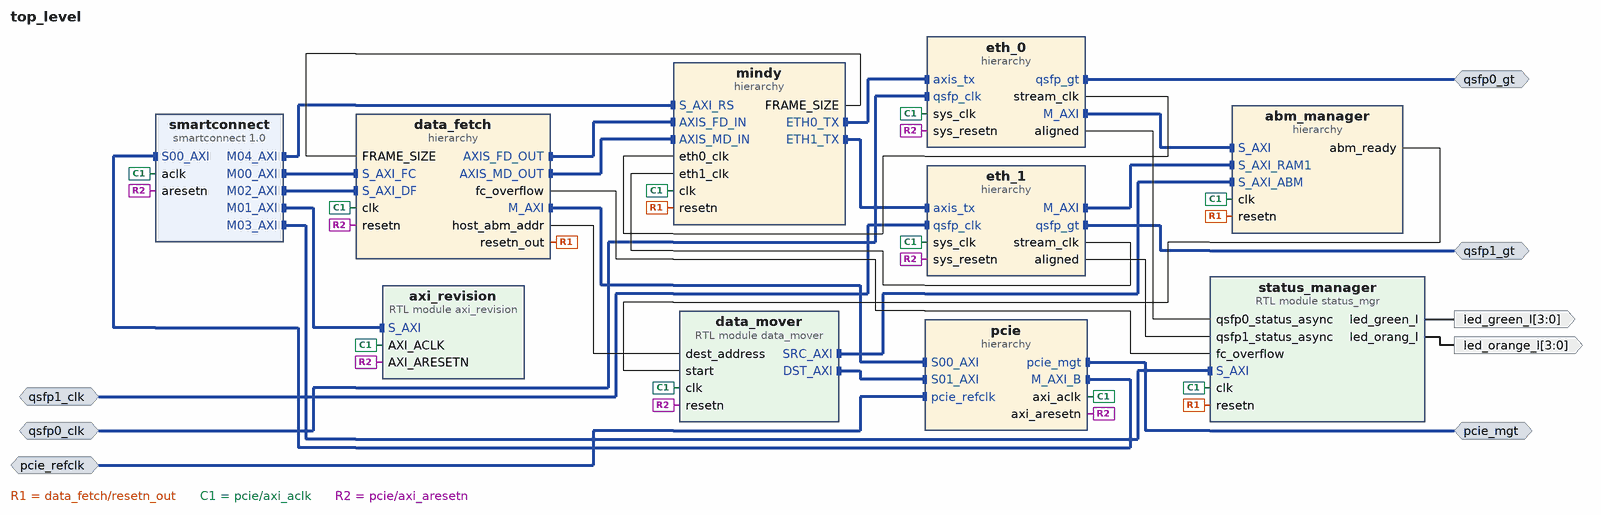
[diagram p0: block diagram of the top level]
# Vivado block design top_level, xcvu3p-ffvc1517-2-e, Vivado 2021.1
create_bd_design top_level

create_bd_intf_port -mode Slave -vlnv xilinx.com:interface:diff_clock_rtl:1.0 pcie_refclk
create_bd_intf_port -mode Master -vlnv xilinx.com:interface:pcie_7x_mgt_rtl:1.0 pcie_mgt
create_bd_intf_port -mode Slave -vlnv xilinx.com:interface:diff_clock_rtl:1.0 qsfp0_clk
set_property -dict {CONFIG.FREQ_HZ 322265625} [get_bd_intf_ports qsfp0_clk]
create_bd_intf_port -mode Master -vlnv xilinx.com:interface:gt_rtl:1.0 qsfp0_gt
create_bd_intf_port -mode Master -vlnv xilinx.com:interface:gt_rtl:1.0 qsfp1_gt
create_bd_intf_port -mode Slave -vlnv xilinx.com:interface:diff_clock_rtl:1.0 qsfp1_clk
set_property -dict {CONFIG.FREQ_HZ 322265625} [get_bd_intf_ports qsfp1_clk]
create_bd_port -dir O -from 3 -to 0 led_orange_l
create_bd_port -dir O -from 3 -to 0 led_green_l

create_bd_cell -type hier pcie
create_bd_cell -type hier eth_1
create_bd_cell -type ip -vlnv xilinx.com:ip:smartconnect:1.0 smartconnect
set_property -dict {CONFIG.NUM_CLKS 1 CONFIG.NUM_MI 5 CONFIG.NUM_SI 1} [get_bd_cells smartconnect]
create_bd_cell -type hier data_fetch
create_bd_cell -type hier mindy
create_bd_cell -type hier abm_manager
create_bd_cell -type module -reference axi_revision axi_revision
create_bd_cell -type hier eth_0
create_bd_cell -type module -reference status_mgr status_manager
create_bd_cell -type module -reference data_mover data_mover

# ---- hierarchy /pcie ----
current_bd_instance /pcie
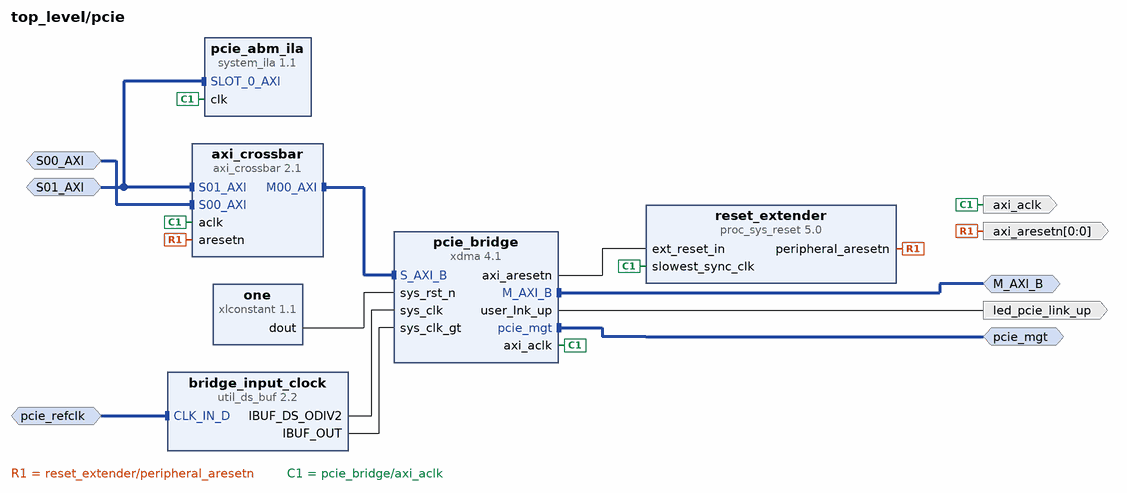
[diagram p1: block diagram inside /pcie]
create_bd_intf_pin -mode Master -vlnv xilinx.com:interface:aximm_rtl:1.0 M_AXI_B
create_bd_intf_pin -mode Master -vlnv xilinx.com:interface:pcie_7x_mgt_rtl:1.0 pcie_mgt
create_bd_intf_pin -mode Slave -vlnv xilinx.com:interface:diff_clock_rtl:1.0 pcie_refclk
create_bd_intf_pin -mode Slave -vlnv xilinx.com:interface:aximm_rtl:1.0 S00_AXI
create_bd_intf_pin -mode Slave -vlnv xilinx.com:interface:aximm_rtl:1.0 S01_AXI
create_bd_pin -dir O led_pcie_link_up
create_bd_pin -dir O -type clk axi_aclk
create_bd_pin -dir O -from 0 -to 0 -type rst axi_aresetn

create_bd_cell -type ip -vlnv xilinx.com:ip:proc_sys_reset:5.0 reset_extender
create_bd_cell -type ip -vlnv xilinx.com:ip:util_ds_buf:2.2 bridge_input_clock
set_property -dict {CONFIG.C_BUF_TYPE IBUFDSGTE} [get_bd_cells bridge_input_clock]
create_bd_cell -type ip -vlnv xilinx.com:ip:xdma:4.1 pcie_bridge
set_property -dict [list \
  CONFIG.PF0_DEVICE_ID_mqdma 903F \
  CONFIG.PF0_SRIOV_VF_DEVICE_ID A03F \
  CONFIG.PF2_DEVICE_ID_mqdma 923F \
  CONFIG.PF3_DEVICE_ID_mqdma 933F \
  CONFIG.axi_addr_width 64 \
  CONFIG.axi_data_width 512_bit \
  CONFIG.axisten_freq 250 \
  CONFIG.bridge_burst true \
  CONFIG.dma_reset_source_sel User_Reset \
  CONFIG.en_axi_slave_if true \
  CONFIG.enable_jtag_dbg false \
  CONFIG.functional_mode AXI_Bridge \
  CONFIG.mode_selection Advanced \
  CONFIG.pcie_blk_locn X1Y0 \
  CONFIG.pf0_bar0_scale Megabytes \
  CONFIG.pf0_bar0_size 1 \
  CONFIG.pf0_device_id 903F \
  CONFIG.pl_link_cap_max_link_speed 8.0_GT/s \
  CONFIG.pl_link_cap_max_link_width X16 \
  CONFIG.plltype QPLL1 \
] [get_bd_cells pcie_bridge]
create_bd_cell -type ip -vlnv xilinx.com:ip:xlconstant:1.1 one
create_bd_cell -type ip -vlnv xilinx.com:ip:axi_crossbar:2.1 axi_crossbar
set_property -dict [list \
  CONFIG.M00_S00_READ_CONNECTIVITY 1 \
  CONFIG.M00_S00_WRITE_CONNECTIVITY 0 \
  CONFIG.M00_S01_READ_CONNECTIVITY 0 \
  CONFIG.M00_S01_WRITE_CONNECTIVITY 1 \
  CONFIG.NUM_MI 1 \
  CONFIG.NUM_SI 2 \
  CONFIG.S00_ARB_PRIORITY 15 \
  CONFIG.S01_ARB_PRIORITY 1 \
  CONFIG.STRATEGY 2 \
] [get_bd_cells axi_crossbar]
create_bd_cell -type ip -vlnv xilinx.com:ip:system_ila:1.1 pcie_abm_ila

# ---- hierarchy /eth_1 ----
current_bd_instance /eth_1
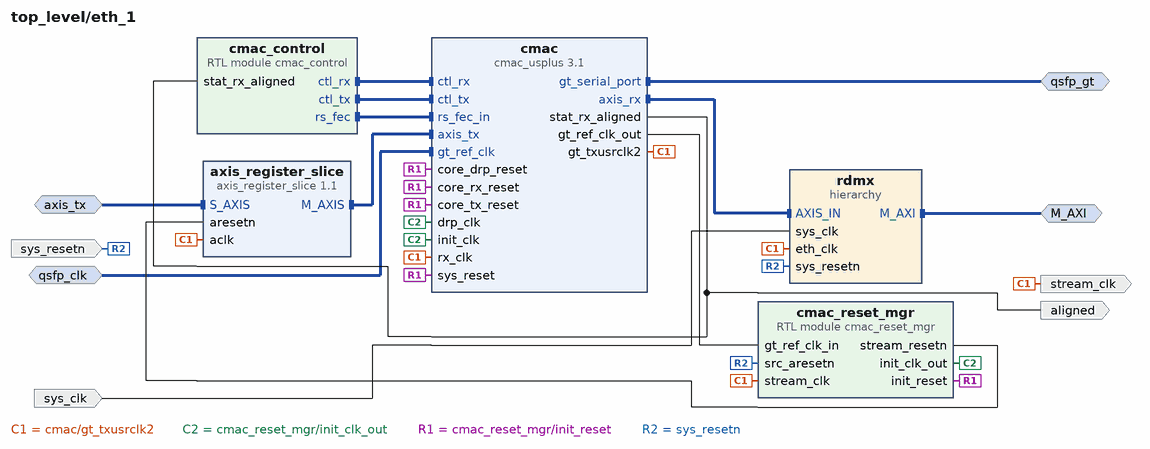
[diagram p2: block diagram inside /eth_1]
create_bd_intf_pin -mode Master -vlnv xilinx.com:interface:gt_rtl:1.0 qsfp_gt
create_bd_intf_pin -mode Slave -vlnv xilinx.com:interface:axis_rtl:1.0 axis_tx
create_bd_intf_pin -mode Slave -vlnv xilinx.com:interface:diff_clock_rtl:1.0 qsfp_clk
create_bd_intf_pin -mode Master -vlnv xilinx.com:interface:aximm_rtl:1.0 M_AXI
create_bd_pin -dir I -type rst sys_resetn
create_bd_pin -dir O -type clk stream_clk
create_bd_pin -dir O aligned
create_bd_pin -dir I sys_clk

create_bd_cell -type ip -vlnv xilinx.com:ip:cmac_usplus:3.1 cmac
set_property -dict [list \
  CONFIG.CMAC_CAUI4_MODE 1 \
  CONFIG.CMAC_CORE_SELECT CMACE4_X0Y0 \
  CONFIG.GT_DRP_CLK 161.132812 \
  CONFIG.GT_GROUP_SELECT {X0Y4~X0Y7} \
  CONFIG.GT_REF_CLK_FREQ 322.265625 \
  CONFIG.INCLUDE_RS_FEC 1 \
  CONFIG.NUM_LANES 4x25 \
  CONFIG.RX_FLOW_CONTROL 0 \
  CONFIG.TX_FLOW_CONTROL 0 \
  CONFIG.USER_INTERFACE AXIS \
] [get_bd_cells cmac]
create_bd_cell -type module -reference cmac_control cmac_control
create_bd_cell -type module -reference cmac_reset_mgr cmac_reset_mgr
create_bd_cell -type ip -vlnv xilinx.com:ip:axis_register_slice:1.1 axis_register_slice
create_bd_cell -type hier rdmx

# ---- hierarchy /eth_1/rdmx ----
current_bd_instance /eth_1/rdmx
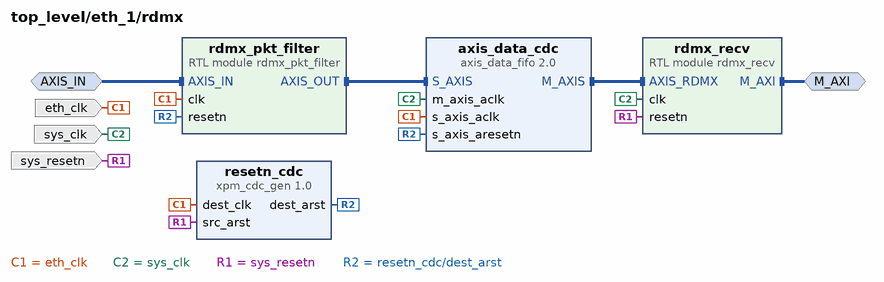
[diagram p3: block diagram inside /eth_1/rdmx]
create_bd_intf_pin -mode Slave -vlnv xilinx.com:interface:axis_rtl:1.0 AXIS_IN
create_bd_intf_pin -mode Master -vlnv xilinx.com:interface:aximm_rtl:1.0 M_AXI
create_bd_pin -dir I eth_clk
create_bd_pin -dir I sys_resetn
create_bd_pin -dir I sys_clk

create_bd_cell -type module -reference rdmx_pkt_filter rdmx_pkt_filter
create_bd_cell -type ip -vlnv xilinx.com:ip:axis_data_fifo:2.0 axis_data_cdc
set_property -dict {CONFIG.FIFO_DEPTH 16 CONFIG.FIFO_MEMORY_TYPE distributed CONFIG.IS_ACLK_ASYNC 1} [get_bd_cells axis_data_cdc]
create_bd_cell -type ip -vlnv xilinx.com:ip:xpm_cdc_gen:1.0 resetn_cdc
set_property -dict {CONFIG.CDC_TYPE xpm_cdc_async_rst} [get_bd_cells resetn_cdc]
create_bd_cell -type module -reference rdmx_recv rdmx_recv

# ---- hierarchy /data_fetch ----
current_bd_instance /data_fetch
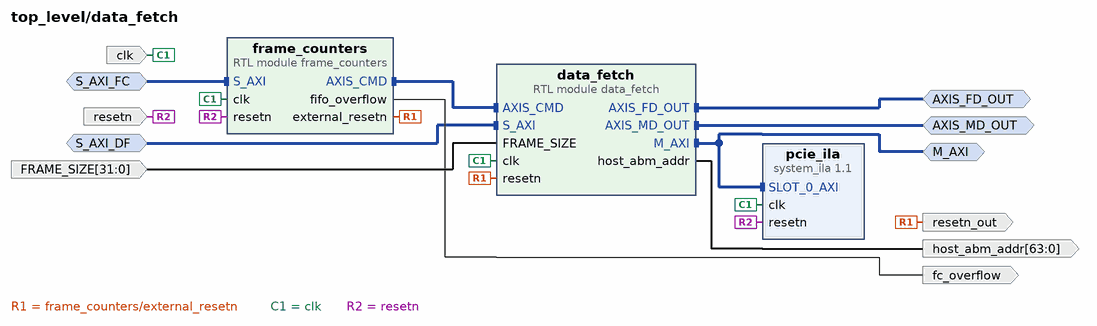
[diagram p4: block diagram inside /data_fetch]
create_bd_intf_pin -mode Slave -vlnv xilinx.com:interface:aximm_rtl:1.0 S_AXI_FC
create_bd_intf_pin -mode Master -vlnv xilinx.com:interface:axis_rtl:1.0 AXIS_MD_OUT
create_bd_intf_pin -mode Master -vlnv xilinx.com:interface:aximm_rtl:1.0 M_AXI
create_bd_intf_pin -mode Slave -vlnv xilinx.com:interface:aximm_rtl:1.0 S_AXI_DF
create_bd_intf_pin -mode Master -vlnv xilinx.com:interface:axis_rtl:1.0 AXIS_FD_OUT
create_bd_pin -dir I -type clk clk
create_bd_pin -dir I -type rst resetn
create_bd_pin -dir O fc_overflow
create_bd_pin -dir O -type rst resetn_out
create_bd_pin -dir I -from 31 -to 0 FRAME_SIZE
create_bd_pin -dir O -from 63 -to 0 host_abm_addr

create_bd_cell -type module -reference frame_counters frame_counters
create_bd_cell -type ip -vlnv xilinx.com:ip:system_ila:1.1 pcie_ila
set_property -dict [list \
  CONFIG.C_DATA_DEPTH 1024 \
  CONFIG.C_MON_TYPE INTERFACE \
  CONFIG.C_NUM_MONITOR_SLOTS 1 \
  CONFIG.C_NUM_OF_PROBES 3 \
  CONFIG.C_SLOT 0 \
  CONFIG.C_SLOT_1_INTF_TYPE xilinx.com:interface:axis_rtl:1.0 \
  CONFIG.C_SLOT_2_INTF_TYPE xilinx.com:interface:axis_rtl:1.0 \
  CONFIG.C_SLOT_4_INTF_TYPE xilinx.com:interface:axis_rtl:1.0 \
] [get_bd_cells pcie_ila]
create_bd_cell -type module -reference data_fetch data_fetch
set_property -dict {CONFIG.FD_FIFO_DEPTH 16 CONFIG.FD_FIFO_TYPE distributed} [get_bd_cells data_fetch]

# ---- hierarchy /mindy ----
current_bd_instance /mindy
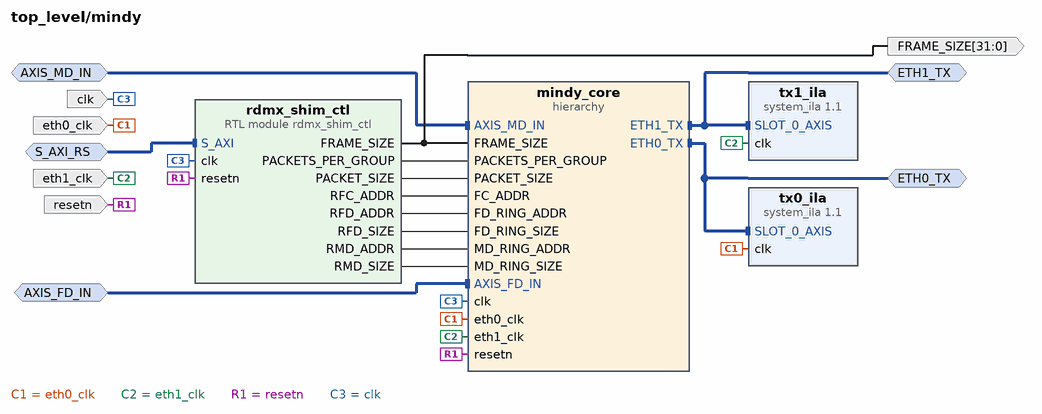
[diagram p5: block diagram inside /mindy]
create_bd_intf_pin -mode Slave -vlnv xilinx.com:interface:aximm_rtl:1.0 S_AXI_RS
create_bd_intf_pin -mode Master -vlnv xilinx.com:interface:axis_rtl:1.0 ETH0_TX
create_bd_intf_pin -mode Master -vlnv xilinx.com:interface:axis_rtl:1.0 ETH1_TX
create_bd_intf_pin -mode Slave -vlnv xilinx.com:interface:axis_rtl:1.0 AXIS_FD_IN
create_bd_intf_pin -mode Slave -vlnv xilinx.com:interface:axis_rtl:1.0 AXIS_MD_IN
create_bd_pin -dir I -type clk clk
create_bd_pin -dir I -type clk eth0_clk
create_bd_pin -dir I -type clk eth1_clk
create_bd_pin -dir I -type rst resetn
create_bd_pin -dir O -from 31 -to 0 FRAME_SIZE

create_bd_cell -type hier mindy_core
create_bd_cell -type module -reference rdmx_shim_ctl rdmx_shim_ctl
create_bd_cell -type ip -vlnv xilinx.com:ip:system_ila:1.1 tx0_ila
set_property -dict {CONFIG.C_SLOT_0_INTF_TYPE xilinx.com:interface:axis_rtl:1.0} [get_bd_cells tx0_ila]
create_bd_cell -type ip -vlnv xilinx.com:ip:system_ila:1.1 tx1_ila
set_property -dict {CONFIG.C_SLOT_0_INTF_TYPE xilinx.com:interface:axis_rtl:1.0} [get_bd_cells tx1_ila]

# ---- hierarchy /mindy/mindy_core ----
current_bd_instance /mindy/mindy_core
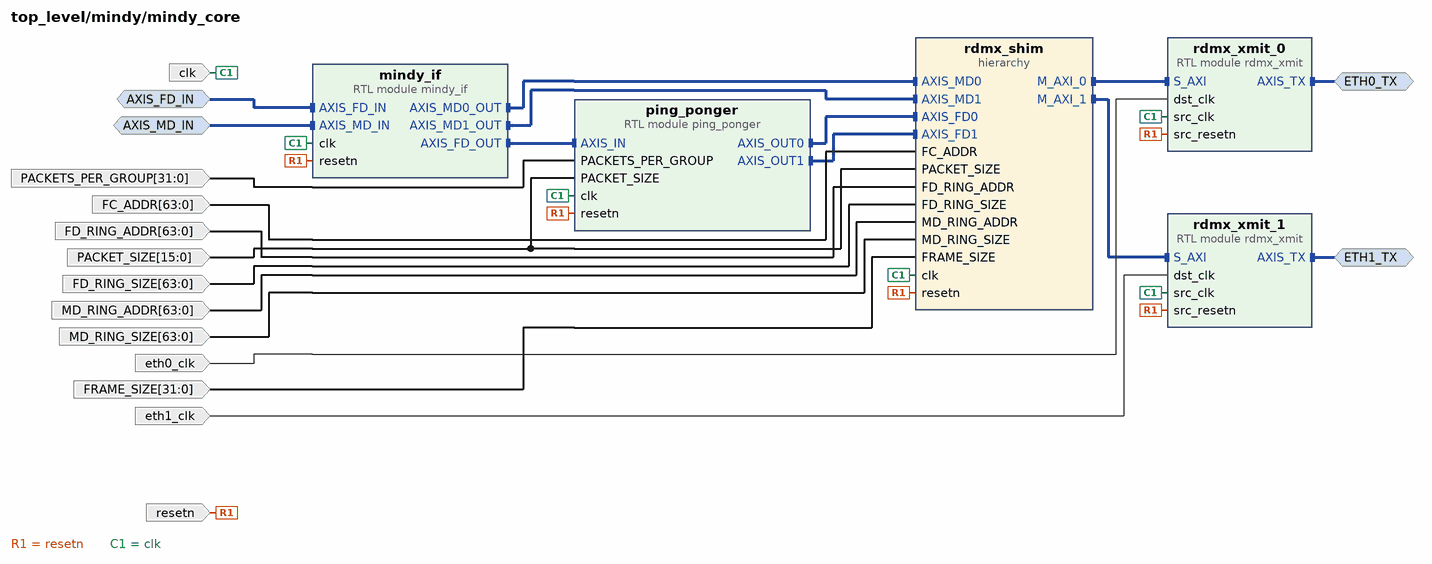
[diagram p6: block diagram inside /mindy/mindy_core]
create_bd_intf_pin -mode Master -vlnv xilinx.com:interface:axis_rtl:1.0 ETH0_TX
create_bd_intf_pin -mode Master -vlnv xilinx.com:interface:axis_rtl:1.0 ETH1_TX
create_bd_intf_pin -mode Slave -vlnv xilinx.com:interface:axis_rtl:1.0 AXIS_FD_IN
create_bd_intf_pin -mode Slave -vlnv xilinx.com:interface:axis_rtl:1.0 AXIS_MD_IN
create_bd_pin -dir I -type clk clk
create_bd_pin -dir I -type clk eth0_clk
create_bd_pin -dir I -type clk eth1_clk
create_bd_pin -dir I -type rst resetn
create_bd_pin -dir I -from 63 -to 0 MD_RING_SIZE
create_bd_pin -dir I -from 15 -to 0 PACKET_SIZE
create_bd_pin -dir I -from 31 -to 0 FRAME_SIZE
create_bd_pin -dir I -from 63 -to 0 MD_RING_ADDR
create_bd_pin -dir I -from 63 -to 0 FC_ADDR
create_bd_pin -dir I -from 63 -to 0 FD_RING_ADDR
create_bd_pin -dir I -from 63 -to 0 FD_RING_SIZE
create_bd_pin -dir I -from 31 -to 0 PACKETS_PER_GROUP

create_bd_cell -type module -reference ping_ponger ping_ponger
create_bd_cell -type hier rdmx_shim
create_bd_cell -type module -reference rdmx_xmit rdmx_xmit_1
create_bd_cell -type module -reference mindy_if mindy_if
create_bd_cell -type module -reference rdmx_xmit rdmx_xmit_0

# ---- hierarchy /mindy/mindy_core/rdmx_shim ----
current_bd_instance /mindy/mindy_core/rdmx_shim
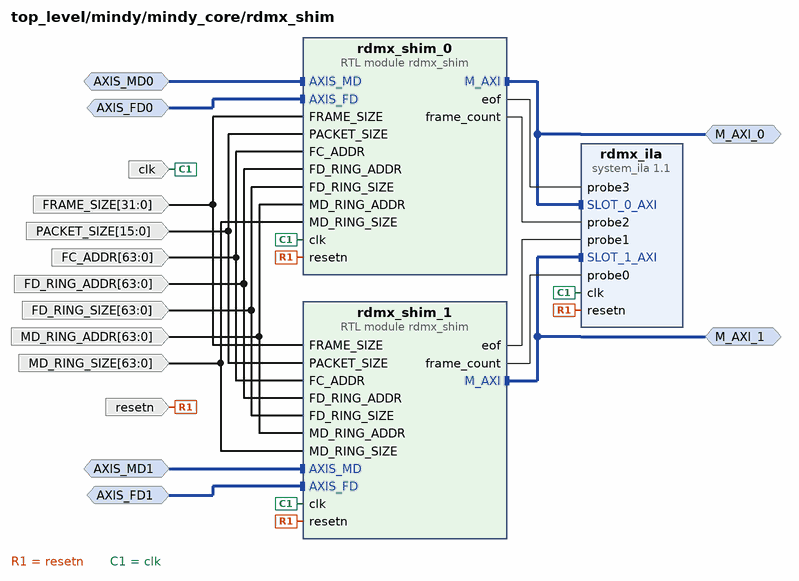
[diagram p7: block diagram inside /mindy/mindy_core/rdmx_shim]
create_bd_intf_pin -mode Slave -vlnv xilinx.com:interface:axis_rtl:1.0 AXIS_FD0
create_bd_intf_pin -mode Slave -vlnv xilinx.com:interface:axis_rtl:1.0 AXIS_MD0
create_bd_intf_pin -mode Master -vlnv xilinx.com:interface:aximm_rtl:1.0 M_AXI_0
create_bd_intf_pin -mode Slave -vlnv xilinx.com:interface:axis_rtl:1.0 AXIS_FD1
create_bd_intf_pin -mode Slave -vlnv xilinx.com:interface:axis_rtl:1.0 AXIS_MD1
create_bd_intf_pin -mode Master -vlnv xilinx.com:interface:aximm_rtl:1.0 M_AXI_1
create_bd_pin -dir I -type clk clk
create_bd_pin -dir I -type rst resetn
create_bd_pin -dir I -from 15 -to 0 PACKET_SIZE
create_bd_pin -dir I -from 63 -to 0 MD_RING_SIZE
create_bd_pin -dir I -from 63 -to 0 MD_RING_ADDR
create_bd_pin -dir I -from 63 -to 0 FC_ADDR
create_bd_pin -dir I -from 31 -to 0 FRAME_SIZE
create_bd_pin -dir I -from 63 -to 0 FD_RING_ADDR
create_bd_pin -dir I -from 63 -to 0 FD_RING_SIZE

create_bd_cell -type ip -vlnv xilinx.com:ip:system_ila:1.1 rdmx_ila
set_property -dict {CONFIG.C_MON_TYPE MIX CONFIG.C_NUM_MONITOR_SLOTS 2 CONFIG.C_NUM_OF_PROBES 4} [get_bd_cells rdmx_ila]
create_bd_cell -type module -reference rdmx_shim rdmx_shim_0
create_bd_cell -type module -reference rdmx_shim rdmx_shim_1

# ---- hierarchy /abm_manager ----
current_bd_instance /abm_manager
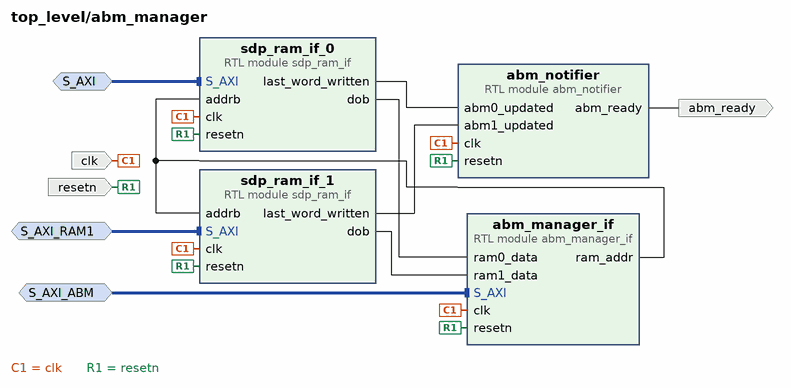
[diagram p8: block diagram inside /abm_manager]
create_bd_intf_pin -mode Slave -vlnv xilinx.com:interface:aximm_rtl:1.0 S_AXI_ABM
create_bd_intf_pin -mode Slave -vlnv xilinx.com:interface:aximm_rtl:1.0 S_AXI_RAM1
create_bd_intf_pin -mode Slave -vlnv xilinx.com:interface:aximm_rtl:1.0 S_AXI
create_bd_pin -dir I clk
create_bd_pin -dir I resetn
create_bd_pin -dir O abm_ready

create_bd_cell -type module -reference abm_manager_if abm_manager_if
create_bd_cell -type module -reference abm_notifier abm_notifier
create_bd_cell -type module -reference sdp_ram_if sdp_ram_if_0
create_bd_cell -type module -reference sdp_ram_if sdp_ram_if_1

# ---- hierarchy /eth_0 ----
current_bd_instance /eth_0
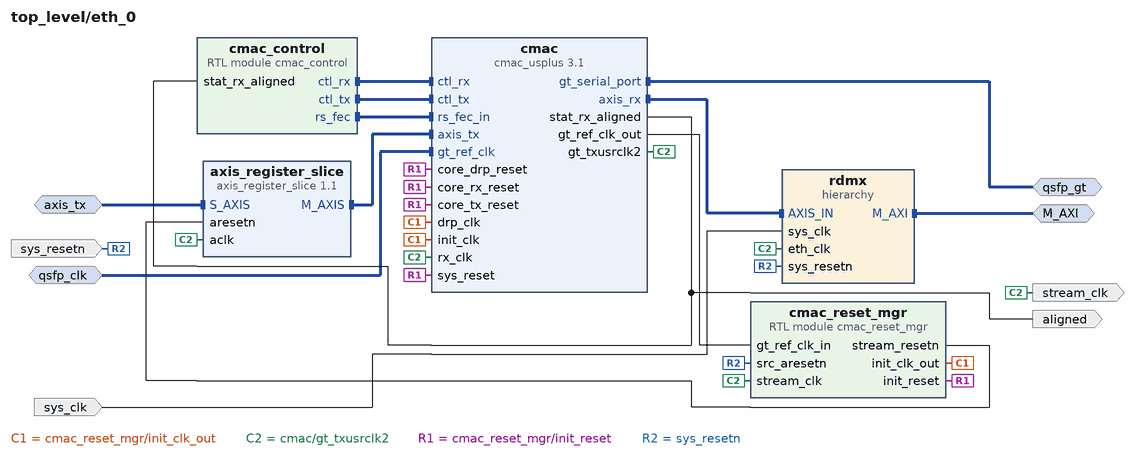
[diagram p9: block diagram inside /eth_0]
create_bd_intf_pin -mode Master -vlnv xilinx.com:interface:gt_rtl:1.0 qsfp_gt
create_bd_intf_pin -mode Slave -vlnv xilinx.com:interface:diff_clock_rtl:1.0 qsfp_clk
create_bd_intf_pin -mode Slave -vlnv xilinx.com:interface:axis_rtl:1.0 axis_tx
create_bd_intf_pin -mode Master -vlnv xilinx.com:interface:aximm_rtl:1.0 M_AXI
create_bd_pin -dir I -type rst sys_resetn
create_bd_pin -dir O -type clk stream_clk
create_bd_pin -dir O aligned
create_bd_pin -dir I sys_clk

create_bd_cell -type module -reference cmac_control cmac_control
create_bd_cell -type ip -vlnv xilinx.com:ip:cmac_usplus:3.1 cmac
set_property -dict [list \
  CONFIG.CMAC_CAUI4_MODE 1 \
  CONFIG.CMAC_CORE_SELECT CMACE4_X0Y2 \
  CONFIG.GT_DRP_CLK 161.132812 \
  CONFIG.GT_GROUP_SELECT {X0Y16~X0Y19} \
  CONFIG.GT_REF_CLK_FREQ 322.265625 \
  CONFIG.INCLUDE_RS_FEC 1 \
  CONFIG.NUM_LANES 4x25 \
  CONFIG.RX_FLOW_CONTROL 0 \
  CONFIG.TX_FLOW_CONTROL 0 \
  CONFIG.USER_INTERFACE AXIS \
] [get_bd_cells cmac]
create_bd_cell -type module -reference cmac_reset_mgr cmac_reset_mgr
create_bd_cell -type ip -vlnv xilinx.com:ip:axis_register_slice:1.1 axis_register_slice
create_bd_cell -type hier rdmx

# ---- hierarchy /eth_0/rdmx ----
current_bd_instance /eth_0/rdmx
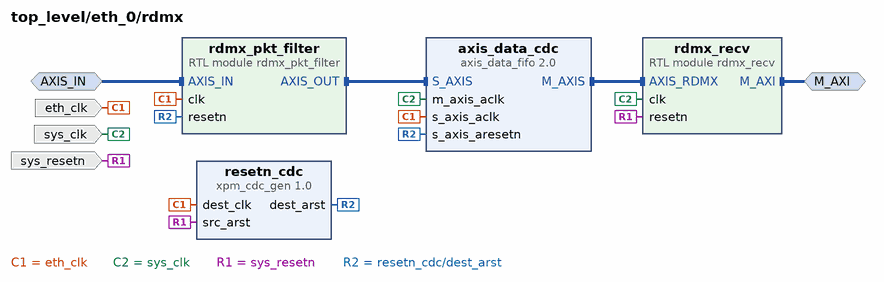
[diagram p10: block diagram inside /eth_0/rdmx]
create_bd_intf_pin -mode Slave -vlnv xilinx.com:interface:axis_rtl:1.0 AXIS_IN
create_bd_intf_pin -mode Master -vlnv xilinx.com:interface:aximm_rtl:1.0 M_AXI
create_bd_pin -dir I eth_clk
create_bd_pin -dir I sys_resetn
create_bd_pin -dir I sys_clk

create_bd_cell -type module -reference rdmx_pkt_filter rdmx_pkt_filter
create_bd_cell -type ip -vlnv xilinx.com:ip:axis_data_fifo:2.0 axis_data_cdc
set_property -dict {CONFIG.FIFO_DEPTH 16 CONFIG.FIFO_MEMORY_TYPE distributed CONFIG.IS_ACLK_ASYNC 1} [get_bd_cells axis_data_cdc]
create_bd_cell -type ip -vlnv xilinx.com:ip:xpm_cdc_gen:1.0 resetn_cdc
set_property -dict {CONFIG.CDC_TYPE xpm_cdc_async_rst} [get_bd_cells resetn_cdc]
create_bd_cell -type module -reference rdmx_recv rdmx_recv

# ---- connections ----

current_bd_instance /pcie
connect_bd_intf_net [get_bd_intf_pins S01_AXI] [get_bd_intf_pins axi_crossbar/S01_AXI]
connect_bd_intf_net [get_bd_intf_pins S01_AXI] [get_bd_intf_pins pcie_abm_ila/SLOT_0_AXI]
connect_bd_intf_net [get_bd_intf_pins pcie_refclk] [get_bd_intf_pins bridge_input_clock/CLK_IN_D]
connect_bd_intf_net [get_bd_intf_pins S00_AXI] [get_bd_intf_pins axi_crossbar/S00_AXI]
connect_bd_intf_net [get_bd_intf_pins pcie_bridge/S_AXI_B] [get_bd_intf_pins axi_crossbar/M00_AXI]
connect_bd_intf_net [get_bd_intf_pins M_AXI_B] [get_bd_intf_pins pcie_bridge/M_AXI_B]
connect_bd_intf_net [get_bd_intf_pins pcie_mgt] [get_bd_intf_pins pcie_bridge/pcie_mgt]
connect_bd_net [get_bd_pins bridge_input_clock/IBUF_DS_ODIV2] [get_bd_pins pcie_bridge/sys_clk]
connect_bd_net [get_bd_pins bridge_input_clock/IBUF_OUT] [get_bd_pins pcie_bridge/sys_clk_gt]
connect_bd_net [get_bd_pins one/dout] [get_bd_pins pcie_bridge/sys_rst_n]
connect_bd_net [get_bd_pins pcie_bridge/axi_aresetn] [get_bd_pins reset_extender/ext_reset_in]
connect_bd_net -net proc_sys_reset_0_peripheral_aresetn [get_bd_pins reset_extender/peripheral_aresetn] \
  [get_bd_pins axi_aresetn] [get_bd_pins axi_crossbar/aresetn]
connect_bd_net -net xdma_0_axi_aclk [get_bd_pins pcie_bridge/axi_aclk] \
  [get_bd_pins axi_aclk] [get_bd_pins reset_extender/slowest_sync_clk] [get_bd_pins axi_crossbar/aclk] \
  [get_bd_pins pcie_abm_ila/clk]
connect_bd_net -net xdma_0_user_lnk_up [get_bd_pins pcie_bridge/user_lnk_up] [get_bd_pins led_pcie_link_up]

current_bd_instance /eth_1
connect_bd_intf_net [get_bd_intf_pins M_AXI] [get_bd_intf_pins rdmx/M_AXI]
connect_bd_intf_net [get_bd_intf_pins qsfp_clk] [get_bd_intf_pins cmac/gt_ref_clk]
connect_bd_intf_net [get_bd_intf_pins cmac/axis_tx] [get_bd_intf_pins axis_register_slice/M_AXIS]
connect_bd_intf_net [get_bd_intf_pins axis_tx] [get_bd_intf_pins axis_register_slice/S_AXIS]
connect_bd_intf_net [get_bd_intf_pins cmac/axis_rx] [get_bd_intf_pins rdmx/AXIS_IN]
connect_bd_intf_net [get_bd_intf_pins cmac_control/ctl_rx] [get_bd_intf_pins cmac/ctl_rx]
connect_bd_intf_net [get_bd_intf_pins cmac_control/ctl_tx] [get_bd_intf_pins cmac/ctl_tx]
connect_bd_intf_net [get_bd_intf_pins cmac_control/rs_fec] [get_bd_intf_pins cmac/rs_fec_in]
connect_bd_intf_net [get_bd_intf_pins qsfp_gt] [get_bd_intf_pins cmac/gt_serial_port]
connect_bd_net -net clk_0_1 [get_bd_pins cmac/gt_ref_clk_out] [get_bd_pins cmac_reset_mgr/gt_ref_clk_in]
connect_bd_net -net cmac_gt_rxusrclk2 [get_bd_pins cmac/gt_txusrclk2] \
  [get_bd_pins stream_clk] [get_bd_pins cmac/rx_clk] [get_bd_pins cmac_reset_mgr/stream_clk] \
  [get_bd_pins axis_register_slice/aclk] [get_bd_pins rdmx/eth_clk]
connect_bd_net -net cmac_reset_mgr_0_stream_resetn [get_bd_pins cmac_reset_mgr/stream_resetn] [get_bd_pins axis_register_slice/aresetn]
connect_bd_net [get_bd_pins cmac/stat_rx_aligned] [get_bd_pins aligned] [get_bd_pins cmac_control/stat_rx_aligned]
connect_bd_net -net init_clk_divider_init_clk [get_bd_pins cmac_reset_mgr/init_clk_out] [get_bd_pins cmac/init_clk] [get_bd_pins cmac/drp_clk]
connect_bd_net -net init_reset [get_bd_pins cmac_reset_mgr/init_reset] \
  [get_bd_pins cmac/sys_reset] [get_bd_pins cmac/core_rx_reset] [get_bd_pins cmac/core_tx_reset] \
  [get_bd_pins cmac/core_drp_reset]
connect_bd_net [get_bd_pins sys_clk] [get_bd_pins rdmx/sys_clk]
connect_bd_net -net sys_reset_1 [get_bd_pins sys_resetn] [get_bd_pins cmac_reset_mgr/src_aresetn] [get_bd_pins rdmx/sys_resetn]

current_bd_instance /eth_1/rdmx
connect_bd_intf_net [get_bd_intf_pins AXIS_IN] [get_bd_intf_pins rdmx_pkt_filter/AXIS_IN]
connect_bd_intf_net [get_bd_intf_pins rdmx_recv/AXIS_RDMX] [get_bd_intf_pins axis_data_cdc/M_AXIS]
connect_bd_intf_net [get_bd_intf_pins rdmx_pkt_filter/AXIS_OUT] [get_bd_intf_pins axis_data_cdc/S_AXIS]
connect_bd_intf_net [get_bd_intf_pins M_AXI] [get_bd_intf_pins rdmx_recv/M_AXI]
connect_bd_net -net clk_1 [get_bd_pins eth_clk] \
  [get_bd_pins rdmx_pkt_filter/clk] [get_bd_pins resetn_cdc/dest_clk] [get_bd_pins axis_data_cdc/s_axis_aclk]
connect_bd_net [get_bd_pins sys_clk] [get_bd_pins axis_data_cdc/m_axis_aclk] [get_bd_pins rdmx_recv/clk]
connect_bd_net [get_bd_pins sys_resetn] [get_bd_pins resetn_cdc/src_arst] [get_bd_pins rdmx_recv/resetn]
connect_bd_net -net xpm_cdc_gen_0_dest_arst [get_bd_pins resetn_cdc/dest_arst] \
  [get_bd_pins rdmx_pkt_filter/resetn] [get_bd_pins axis_data_cdc/s_axis_aresetn]

current_bd_instance /data_fetch
connect_bd_intf_net [get_bd_intf_pins frame_counters/AXIS_CMD] [get_bd_intf_pins data_fetch/AXIS_CMD]
connect_bd_intf_net [get_bd_intf_pins AXIS_FD_OUT] [get_bd_intf_pins data_fetch/AXIS_FD_OUT]
connect_bd_intf_net [get_bd_intf_pins AXIS_MD_OUT] [get_bd_intf_pins data_fetch/AXIS_MD_OUT]
connect_bd_intf_net [get_bd_intf_pins M_AXI] [get_bd_intf_pins data_fetch/M_AXI]
connect_bd_intf_net [get_bd_intf_pins M_AXI] [get_bd_intf_pins pcie_ila/SLOT_0_AXI]
connect_bd_intf_net [get_bd_intf_pins S_AXI_FC] [get_bd_intf_pins frame_counters/S_AXI]
connect_bd_intf_net [get_bd_intf_pins S_AXI_DF] [get_bd_intf_pins data_fetch/S_AXI]
connect_bd_net [get_bd_pins data_fetch/host_abm_addr] [get_bd_pins host_abm_addr]
connect_bd_net [get_bd_pins frame_counters/external_resetn] [get_bd_pins resetn_out] [get_bd_pins data_fetch/resetn]
connect_bd_net [get_bd_pins frame_counters/fifo_overflow] [get_bd_pins fc_overflow]
connect_bd_net -net mindy_FRAME_SIZE [get_bd_pins FRAME_SIZE] [get_bd_pins data_fetch/FRAME_SIZE]
connect_bd_net -net source_200Mhz_clk [get_bd_pins clk] [get_bd_pins frame_counters/clk] [get_bd_pins pcie_ila/clk] [get_bd_pins data_fetch/clk]
connect_bd_net -net source_200Mhz_resetn [get_bd_pins resetn] [get_bd_pins frame_counters/resetn] [get_bd_pins pcie_ila/resetn]

current_bd_instance /mindy
connect_bd_intf_net [get_bd_intf_pins AXIS_MD_IN] [get_bd_intf_pins mindy_core/AXIS_MD_IN]
connect_bd_intf_net [get_bd_intf_pins ETH0_TX] [get_bd_intf_pins mindy_core/ETH0_TX]
connect_bd_intf_net [get_bd_intf_pins ETH0_TX] [get_bd_intf_pins tx0_ila/SLOT_0_AXIS]
connect_bd_intf_net [get_bd_intf_pins ETH1_TX] [get_bd_intf_pins mindy_core/ETH1_TX]
connect_bd_intf_net [get_bd_intf_pins ETH1_TX] [get_bd_intf_pins tx1_ila/SLOT_0_AXIS]
connect_bd_intf_net [get_bd_intf_pins S_AXI_RS] [get_bd_intf_pins rdmx_shim_ctl/S_AXI]
connect_bd_intf_net [get_bd_intf_pins AXIS_FD_IN] [get_bd_intf_pins mindy_core/AXIS_FD_IN]
connect_bd_net -net eth_0_stream_clk [get_bd_pins eth0_clk] [get_bd_pins mindy_core/eth0_clk] [get_bd_pins tx0_ila/clk]
connect_bd_net -net eth_1_stream_clk [get_bd_pins eth1_clk] [get_bd_pins mindy_core/eth1_clk] [get_bd_pins tx1_ila/clk]
connect_bd_net -net frame_counters_external_resetn [get_bd_pins resetn] [get_bd_pins mindy_core/resetn] [get_bd_pins rdmx_shim_ctl/resetn]
connect_bd_net [get_bd_pins rdmx_shim_ctl/FRAME_SIZE] [get_bd_pins FRAME_SIZE] [get_bd_pins mindy_core/FRAME_SIZE]
connect_bd_net [get_bd_pins rdmx_shim_ctl/PACKETS_PER_GROUP] [get_bd_pins mindy_core/PACKETS_PER_GROUP]
connect_bd_net [get_bd_pins rdmx_shim_ctl/PACKET_SIZE] [get_bd_pins mindy_core/PACKET_SIZE]
connect_bd_net [get_bd_pins rdmx_shim_ctl/RFC_ADDR] [get_bd_pins mindy_core/FC_ADDR]
connect_bd_net [get_bd_pins rdmx_shim_ctl/RFD_ADDR] [get_bd_pins mindy_core/FD_RING_ADDR]
connect_bd_net [get_bd_pins rdmx_shim_ctl/RFD_SIZE] [get_bd_pins mindy_core/FD_RING_SIZE]
connect_bd_net [get_bd_pins rdmx_shim_ctl/RMD_ADDR] [get_bd_pins mindy_core/MD_RING_ADDR]
connect_bd_net [get_bd_pins rdmx_shim_ctl/RMD_SIZE] [get_bd_pins mindy_core/MD_RING_SIZE]
connect_bd_net -net source_200Mhz_clk [get_bd_pins clk] [get_bd_pins mindy_core/clk] [get_bd_pins rdmx_shim_ctl/clk]

current_bd_instance /mindy/mindy_core
connect_bd_intf_net [get_bd_intf_pins AXIS_FD_IN] [get_bd_intf_pins mindy_if/AXIS_FD_IN]
connect_bd_intf_net [get_bd_intf_pins mindy_if/AXIS_MD0_OUT] [get_bd_intf_pins rdmx_shim/AXIS_MD0]
connect_bd_intf_net [get_bd_intf_pins mindy_if/AXIS_MD1_OUT] [get_bd_intf_pins rdmx_shim/AXIS_MD1]
connect_bd_intf_net [get_bd_intf_pins AXIS_MD_IN] [get_bd_intf_pins mindy_if/AXIS_MD_IN]
connect_bd_intf_net [get_bd_intf_pins mindy_if/AXIS_FD_OUT] [get_bd_intf_pins ping_ponger/AXIS_IN]
connect_bd_intf_net [get_bd_intf_pins ping_ponger/AXIS_OUT0] [get_bd_intf_pins rdmx_shim/AXIS_FD0]
connect_bd_intf_net [get_bd_intf_pins ping_ponger/AXIS_OUT1] [get_bd_intf_pins rdmx_shim/AXIS_FD1]
connect_bd_intf_net [get_bd_intf_pins rdmx_shim/M_AXI_0] [get_bd_intf_pins rdmx_xmit_0/S_AXI]
connect_bd_intf_net [get_bd_intf_pins rdmx_shim/M_AXI_1] [get_bd_intf_pins rdmx_xmit_1/S_AXI]
connect_bd_intf_net [get_bd_intf_pins ETH0_TX] [get_bd_intf_pins rdmx_xmit_0/AXIS_TX]
connect_bd_intf_net [get_bd_intf_pins ETH1_TX] [get_bd_intf_pins rdmx_xmit_1/AXIS_TX]
connect_bd_net [get_bd_pins FC_ADDR] [get_bd_pins rdmx_shim/FC_ADDR]
connect_bd_net [get_bd_pins FD_RING_ADDR] [get_bd_pins rdmx_shim/FD_RING_ADDR]
connect_bd_net [get_bd_pins FD_RING_SIZE] [get_bd_pins rdmx_shim/FD_RING_SIZE]
connect_bd_net [get_bd_pins MD_RING_ADDR] [get_bd_pins rdmx_shim/MD_RING_ADDR]
connect_bd_net [get_bd_pins MD_RING_SIZE] [get_bd_pins rdmx_shim/MD_RING_SIZE]
connect_bd_net [get_bd_pins PACKETS_PER_GROUP] [get_bd_pins ping_ponger/PACKETS_PER_GROUP]
connect_bd_net [get_bd_pins eth0_clk] [get_bd_pins rdmx_xmit_0/dst_clk]
connect_bd_net [get_bd_pins eth1_clk] [get_bd_pins rdmx_xmit_1/dst_clk]
connect_bd_net -net frame_counters_external_resetn [get_bd_pins resetn] \
  [get_bd_pins ping_ponger/resetn] [get_bd_pins rdmx_shim/resetn] [get_bd_pins rdmx_xmit_1/src_resetn] \
  [get_bd_pins mindy_if/resetn] [get_bd_pins rdmx_xmit_0/src_resetn]
connect_bd_net -net rdmx_shim_ctl_FRAME_SIZE [get_bd_pins FRAME_SIZE] [get_bd_pins rdmx_shim/FRAME_SIZE]
connect_bd_net -net rdmx_shim_ctl_PACKET_SIZE [get_bd_pins PACKET_SIZE] [get_bd_pins rdmx_shim/PACKET_SIZE] [get_bd_pins ping_ponger/PACKET_SIZE]
connect_bd_net -net source_200Mhz_clk [get_bd_pins clk] \
  [get_bd_pins ping_ponger/clk] [get_bd_pins rdmx_shim/clk] [get_bd_pins rdmx_xmit_1/src_clk] [get_bd_pins mindy_if/clk] \
  [get_bd_pins rdmx_xmit_0/src_clk]

current_bd_instance /mindy/mindy_core/rdmx_shim
connect_bd_intf_net [get_bd_intf_pins AXIS_MD0] [get_bd_intf_pins rdmx_shim_0/AXIS_MD]
connect_bd_intf_net [get_bd_intf_pins AXIS_MD1] [get_bd_intf_pins rdmx_shim_1/AXIS_MD]
connect_bd_intf_net [get_bd_intf_pins AXIS_FD0] [get_bd_intf_pins rdmx_shim_0/AXIS_FD]
connect_bd_intf_net [get_bd_intf_pins AXIS_FD1] [get_bd_intf_pins rdmx_shim_1/AXIS_FD]
connect_bd_intf_net [get_bd_intf_pins M_AXI_0] [get_bd_intf_pins rdmx_shim_0/M_AXI]
connect_bd_intf_net [get_bd_intf_pins M_AXI_0] [get_bd_intf_pins rdmx_ila/SLOT_0_AXI]
connect_bd_intf_net [get_bd_intf_pins M_AXI_1] [get_bd_intf_pins rdmx_shim_1/M_AXI]
connect_bd_intf_net [get_bd_intf_pins M_AXI_1] [get_bd_intf_pins rdmx_ila/SLOT_1_AXI]
connect_bd_net -net data_fetch_FRAME_SIZE [get_bd_pins FRAME_SIZE] [get_bd_pins rdmx_shim_0/FRAME_SIZE] [get_bd_pins rdmx_shim_1/FRAME_SIZE]
connect_bd_net -net eof_0 [get_bd_pins rdmx_shim_0/eof] [get_bd_pins rdmx_ila/probe3]
connect_bd_net -net eof_1 [get_bd_pins rdmx_shim_1/eof] [get_bd_pins rdmx_ila/probe1]
connect_bd_net -net frame_count_0 [get_bd_pins rdmx_shim_0/frame_count] [get_bd_pins rdmx_ila/probe2]
connect_bd_net -net frame_count_1 [get_bd_pins rdmx_shim_1/frame_count] [get_bd_pins rdmx_ila/probe0]
connect_bd_net -net frame_counters_external_resetn [get_bd_pins resetn] \
  [get_bd_pins rdmx_ila/resetn] [get_bd_pins rdmx_shim_0/resetn] [get_bd_pins rdmx_shim_1/resetn]
connect_bd_net -net ping_ponger_PACKET_SIZE [get_bd_pins PACKET_SIZE] [get_bd_pins rdmx_shim_0/PACKET_SIZE] [get_bd_pins rdmx_shim_1/PACKET_SIZE]
connect_bd_net -net rdmx_shim_ctl_RFC_ADDR [get_bd_pins FC_ADDR] [get_bd_pins rdmx_shim_0/FC_ADDR] [get_bd_pins rdmx_shim_1/FC_ADDR]
connect_bd_net -net rdmx_shim_ctl_RFD_ADDR [get_bd_pins FD_RING_ADDR] [get_bd_pins rdmx_shim_0/FD_RING_ADDR] [get_bd_pins rdmx_shim_1/FD_RING_ADDR]
connect_bd_net -net rdmx_shim_ctl_RFD_SIZE [get_bd_pins FD_RING_SIZE] [get_bd_pins rdmx_shim_0/FD_RING_SIZE] [get_bd_pins rdmx_shim_1/FD_RING_SIZE]
connect_bd_net -net rdmx_shim_ctl_RMD_ADDR [get_bd_pins MD_RING_ADDR] [get_bd_pins rdmx_shim_0/MD_RING_ADDR] [get_bd_pins rdmx_shim_1/MD_RING_ADDR]
connect_bd_net -net rdmx_shim_ctl_RMD_SIZE [get_bd_pins MD_RING_SIZE] [get_bd_pins rdmx_shim_0/MD_RING_SIZE] [get_bd_pins rdmx_shim_1/MD_RING_SIZE]
connect_bd_net -net source_200Mhz_clk [get_bd_pins clk] [get_bd_pins rdmx_ila/clk] [get_bd_pins rdmx_shim_0/clk] [get_bd_pins rdmx_shim_1/clk]

current_bd_instance /abm_manager
connect_bd_intf_net [get_bd_intf_pins S_AXI] [get_bd_intf_pins sdp_ram_if_0/S_AXI]
connect_bd_intf_net [get_bd_intf_pins S_AXI_ABM] [get_bd_intf_pins abm_manager_if/S_AXI]
connect_bd_intf_net [get_bd_intf_pins S_AXI_RAM1] [get_bd_intf_pins sdp_ram_if_1/S_AXI]
connect_bd_net [get_bd_pins abm_manager_if/ram_addr] [get_bd_pins sdp_ram_if_0/addrb] [get_bd_pins sdp_ram_if_1/addrb]
connect_bd_net [get_bd_pins abm_notifier/abm_ready] [get_bd_pins abm_ready]
connect_bd_net [get_bd_pins clk] \
  [get_bd_pins abm_notifier/clk] [get_bd_pins abm_manager_if/clk] [get_bd_pins sdp_ram_if_0/clk] \
  [get_bd_pins sdp_ram_if_1/clk]
connect_bd_net [get_bd_pins resetn] \
  [get_bd_pins abm_notifier/resetn] [get_bd_pins abm_manager_if/resetn] [get_bd_pins sdp_ram_if_1/resetn] \
  [get_bd_pins sdp_ram_if_0/resetn]
connect_bd_net [get_bd_pins sdp_ram_if_0/dob] [get_bd_pins abm_manager_if/ram0_data]
connect_bd_net [get_bd_pins sdp_ram_if_0/last_word_written] [get_bd_pins abm_notifier/abm0_updated]
connect_bd_net [get_bd_pins sdp_ram_if_1/dob] [get_bd_pins abm_manager_if/ram1_data]
connect_bd_net [get_bd_pins sdp_ram_if_1/last_word_written] [get_bd_pins abm_notifier/abm1_updated]

current_bd_instance /eth_0
connect_bd_intf_net [get_bd_intf_pins M_AXI] [get_bd_intf_pins rdmx/M_AXI]
connect_bd_intf_net [get_bd_intf_pins cmac/axis_tx] [get_bd_intf_pins axis_register_slice/M_AXIS]
connect_bd_intf_net [get_bd_intf_pins axis_tx] [get_bd_intf_pins axis_register_slice/S_AXIS]
connect_bd_intf_net [get_bd_intf_pins cmac/axis_rx] [get_bd_intf_pins rdmx/AXIS_IN]
connect_bd_intf_net [get_bd_intf_pins cmac_control/ctl_rx] [get_bd_intf_pins cmac/ctl_rx]
connect_bd_intf_net [get_bd_intf_pins cmac_control/ctl_tx] [get_bd_intf_pins cmac/ctl_tx]
connect_bd_intf_net [get_bd_intf_pins cmac_control/rs_fec] [get_bd_intf_pins cmac/rs_fec_in]
connect_bd_intf_net [get_bd_intf_pins qsfp_gt] [get_bd_intf_pins cmac/gt_serial_port]
connect_bd_intf_net [get_bd_intf_pins qsfp_clk] [get_bd_intf_pins cmac/gt_ref_clk]
connect_bd_net -net clk_0_1 [get_bd_pins cmac_reset_mgr/init_clk_out] [get_bd_pins cmac/init_clk] [get_bd_pins cmac/drp_clk]
connect_bd_net [get_bd_pins cmac/gt_ref_clk_out] [get_bd_pins cmac_reset_mgr/gt_ref_clk_in]
connect_bd_net -net cmac_gt_rxusrclk2 [get_bd_pins cmac/gt_txusrclk2] \
  [get_bd_pins stream_clk] [get_bd_pins cmac/rx_clk] [get_bd_pins cmac_reset_mgr/stream_clk] \
  [get_bd_pins axis_register_slice/aclk] [get_bd_pins rdmx/eth_clk]
connect_bd_net -net cmac_reset_mgr_0_stream_resetn [get_bd_pins cmac_reset_mgr/stream_resetn] [get_bd_pins axis_register_slice/aresetn]
connect_bd_net [get_bd_pins cmac/stat_rx_aligned] [get_bd_pins aligned] [get_bd_pins cmac_control/stat_rx_aligned]
connect_bd_net -net init_clk_reset_peripheral_reset [get_bd_pins cmac_reset_mgr/init_reset] \
  [get_bd_pins cmac/sys_reset] [get_bd_pins cmac/core_rx_reset] [get_bd_pins cmac/core_tx_reset] \
  [get_bd_pins cmac/core_drp_reset]
connect_bd_net [get_bd_pins sys_clk] [get_bd_pins rdmx/sys_clk]
connect_bd_net -net sys_reset_1 [get_bd_pins sys_resetn] [get_bd_pins cmac_reset_mgr/src_aresetn] [get_bd_pins rdmx/sys_resetn]

current_bd_instance /eth_0/rdmx
connect_bd_intf_net [get_bd_intf_pins AXIS_IN] [get_bd_intf_pins rdmx_pkt_filter/AXIS_IN]
connect_bd_intf_net [get_bd_intf_pins rdmx_recv/AXIS_RDMX] [get_bd_intf_pins axis_data_cdc/M_AXIS]
connect_bd_intf_net [get_bd_intf_pins rdmx_pkt_filter/AXIS_OUT] [get_bd_intf_pins axis_data_cdc/S_AXIS]
connect_bd_intf_net [get_bd_intf_pins M_AXI] [get_bd_intf_pins rdmx_recv/M_AXI]
connect_bd_net -net clk_1 [get_bd_pins eth_clk] \
  [get_bd_pins rdmx_pkt_filter/clk] [get_bd_pins resetn_cdc/dest_clk] [get_bd_pins axis_data_cdc/s_axis_aclk]
connect_bd_net [get_bd_pins sys_clk] [get_bd_pins axis_data_cdc/m_axis_aclk] [get_bd_pins rdmx_recv/clk]
connect_bd_net [get_bd_pins sys_resetn] [get_bd_pins resetn_cdc/src_arst] [get_bd_pins rdmx_recv/resetn]
connect_bd_net -net xpm_cdc_gen_0_dest_arst [get_bd_pins resetn_cdc/dest_arst] \
  [get_bd_pins rdmx_pkt_filter/resetn] [get_bd_pins axis_data_cdc/s_axis_aresetn]

current_bd_instance /
connect_bd_intf_net [get_bd_intf_pins abm_manager/S_AXI_RAM1] [get_bd_intf_pins eth_1/M_AXI]
connect_bd_intf_net [get_bd_intf_pins data_fetch/AXIS_FD_OUT] [get_bd_intf_pins mindy/AXIS_FD_IN]
connect_bd_intf_net [get_bd_intf_pins data_fetch/AXIS_MD_OUT] [get_bd_intf_pins mindy/AXIS_MD_IN]
connect_bd_intf_net [get_bd_intf_pins data_fetch/M_AXI] [get_bd_intf_pins pcie/S00_AXI]
connect_bd_intf_net [get_bd_intf_pins data_mover/DST_AXI] [get_bd_intf_pins pcie/S01_AXI]
connect_bd_intf_net [get_bd_intf_pins data_mover/SRC_AXI] [get_bd_intf_pins abm_manager/S_AXI_ABM]
connect_bd_intf_net [get_bd_intf_pins eth_0/M_AXI] [get_bd_intf_pins abm_manager/S_AXI]
connect_bd_intf_net [get_bd_intf_ports qsfp0_gt] [get_bd_intf_pins eth_0/qsfp_gt]
connect_bd_intf_net [get_bd_intf_ports qsfp1_gt] [get_bd_intf_pins eth_1/qsfp_gt]
connect_bd_intf_net [get_bd_intf_ports qsfp1_clk] [get_bd_intf_pins eth_1/qsfp_clk]
connect_bd_intf_net [get_bd_intf_pins mindy/ETH0_TX] [get_bd_intf_pins eth_0/axis_tx]
connect_bd_intf_net [get_bd_intf_pins mindy/ETH1_TX] [get_bd_intf_pins eth_1/axis_tx]
connect_bd_intf_net [get_bd_intf_ports pcie_refclk] [get_bd_intf_pins pcie/pcie_refclk]
connect_bd_intf_net [get_bd_intf_ports qsfp0_clk] [get_bd_intf_pins eth_0/qsfp_clk]
connect_bd_intf_net [get_bd_intf_pins smartconnect/M00_AXI] [get_bd_intf_pins data_fetch/S_AXI_FC]
connect_bd_intf_net [get_bd_intf_pins axi_revision/S_AXI] [get_bd_intf_pins smartconnect/M01_AXI]
connect_bd_intf_net [get_bd_intf_pins smartconnect/M02_AXI] [get_bd_intf_pins data_fetch/S_AXI_DF]
connect_bd_intf_net [get_bd_intf_pins status_manager/S_AXI] [get_bd_intf_pins smartconnect/M03_AXI]
connect_bd_intf_net [get_bd_intf_pins smartconnect/M04_AXI] [get_bd_intf_pins mindy/S_AXI_RS]
connect_bd_intf_net [get_bd_intf_pins pcie/M_AXI_B] [get_bd_intf_pins smartconnect/S00_AXI]
connect_bd_intf_net [get_bd_intf_ports pcie_mgt] [get_bd_intf_pins pcie/pcie_mgt]
connect_bd_net [get_bd_pins abm_manager/abm_ready] [get_bd_pins data_mover/start]
connect_bd_net [get_bd_pins data_fetch/host_abm_addr] [get_bd_pins data_mover/dest_address]
connect_bd_net -net eth0_clk_1 [get_bd_pins eth_0/stream_clk] [get_bd_pins mindy/eth0_clk]
connect_bd_net [get_bd_pins eth_0/aligned] [get_bd_pins status_manager/qsfp0_status_async]
connect_bd_net [get_bd_pins eth_1/aligned] [get_bd_pins status_manager/qsfp1_status_async]
connect_bd_net [get_bd_pins eth_1/stream_clk] [get_bd_pins mindy/eth1_clk]
connect_bd_net -net frame_counters_external_resetn [get_bd_pins data_fetch/resetn_out] \
  [get_bd_pins mindy/resetn] [get_bd_pins abm_manager/resetn] [get_bd_pins status_manager/resetn]
connect_bd_net -net frame_counters_fifo_overflow [get_bd_pins data_fetch/fc_overflow] [get_bd_pins status_manager/fc_overflow]
connect_bd_net [get_bd_pins mindy/FRAME_SIZE] [get_bd_pins data_fetch/FRAME_SIZE]
connect_bd_net -net source_200Mhz_clk [get_bd_pins pcie/axi_aclk] \
  [get_bd_pins smartconnect/aclk] [get_bd_pins data_fetch/clk] [get_bd_pins mindy/clk] [get_bd_pins abm_manager/clk] \
  [get_bd_pins axi_revision/AXI_ACLK] [get_bd_pins eth_1/sys_clk] [get_bd_pins eth_0/sys_clk] \
  [get_bd_pins status_manager/clk] [get_bd_pins data_mover/clk]
connect_bd_net -net source_200Mhz_resetn [get_bd_pins pcie/axi_aresetn] \
  [get_bd_pins eth_1/sys_resetn] [get_bd_pins smartconnect/aresetn] [get_bd_pins data_fetch/resetn] \
  [get_bd_pins axi_revision/AXI_ARESETN] [get_bd_pins eth_0/sys_resetn] [get_bd_pins data_mover/resetn]
connect_bd_net -net status_mgr_0_led_green_l [get_bd_pins status_manager/led_green_l] [get_bd_ports led_green_l]
connect_bd_net -net status_mgr_0_led_orang_l [get_bd_pins status_manager/led_orang_l] [get_bd_ports led_orange_l]

# ---- address map ----
assign_bd_address -offset 0x0000000000000000 -range 16E -target_address_space [get_bd_addr_spaces data_fetch/data_fetch/M_AXI] [get_bd_addr_segs pcie/pcie_bridge/S_AXI_B/BAR0]
assign_bd_address -offset 0x0000000000000000 -range 16E -target_address_space [get_bd_addr_spaces data_mover/DST_AXI] [get_bd_addr_segs pcie/pcie_bridge/S_AXI_B/BAR0]
assign_bd_address -offset 0x0000000000000000 -range 1M -target_address_space [get_bd_addr_spaces data_mover/SRC_AXI] [get_bd_addr_segs abm_manager/abm_manager_if/S_AXI/reg0]
assign_bd_address -offset 0x0000000000000000 -range 1M -target_address_space [get_bd_addr_spaces eth_0/rdmx/rdmx_recv/M_AXI] [get_bd_addr_segs abm_manager/sdp_ram_if_0/S_AXI/reg0]
assign_bd_address -offset 0x0000000000000000 -range 1M -target_address_space [get_bd_addr_spaces eth_1/rdmx/rdmx_recv/M_AXI] [get_bd_addr_segs abm_manager/sdp_ram_if_1/S_AXI/reg0]
assign_bd_address -offset 0x0000000000000000 -range 16E -target_address_space [get_bd_addr_spaces mindy/mindy_core/rdmx_shim/rdmx_shim_0/M_AXI] [get_bd_addr_segs mindy/mindy_core/rdmx_xmit_0/S_AXI/reg0]
assign_bd_address -offset 0x0000000000000000 -range 16E -target_address_space [get_bd_addr_spaces mindy/mindy_core/rdmx_shim/rdmx_shim_1/M_AXI] [get_bd_addr_segs mindy/mindy_core/rdmx_xmit_1/S_AXI/reg0]
assign_bd_address -offset 0x0000000000000000 -range 256 -target_address_space [get_bd_addr_spaces pcie/pcie_bridge/M_AXI_B] [get_bd_addr_segs axi_revision/S_AXI/reg0]
assign_bd_address -offset 0x0000000000001000 -range 256 -target_address_space [get_bd_addr_spaces pcie/pcie_bridge/M_AXI_B] [get_bd_addr_segs data_fetch/frame_counters/S_AXI/reg0]
assign_bd_address -offset 0x0000000000002000 -range 256 -target_address_space [get_bd_addr_spaces pcie/pcie_bridge/M_AXI_B] [get_bd_addr_segs data_fetch/data_fetch/S_AXI/reg0]
assign_bd_address -offset 0x0000000000004000 -range 256 -target_address_space [get_bd_addr_spaces pcie/pcie_bridge/M_AXI_B] [get_bd_addr_segs mindy/rdmx_shim_ctl/S_AXI/reg0]
assign_bd_address -offset 0x0000000000005000 -range 256 -target_address_space [get_bd_addr_spaces pcie/pcie_bridge/M_AXI_B] [get_bd_addr_segs status_manager/S_AXI/reg0]
exclude_bd_addr_seg -offset 0x0000000020000000 -range 512M -target_address_space [get_bd_addr_spaces pcie/pcie_bridge/M_AXI_B] [get_bd_addr_segs pcie/pcie_bridge/S_AXI_LITE/CTL0]

validate_bd_design
save_bd_design
